# Altium schematic sheet Ethernet.SchDoc
size A3; DocumentNumber: 7; SheetNumber: 7; SheetTotal: 10; PageSetup: Record=PageOptions|CenterHorizontal=True|CenterVertical=True|PrintScale=0.97|XCorrection=1.00|YCorrection=1.00|PrintKind=1|BorderSize=5000000|LeftOffset=0|BottomOffset=0|Orientation=2|PaperLength=2970|PaperWidth=2100|Scale=100|PaperSource=7|PrintQuality=600|MediaType=1|DitherType=10|PaperKind=A4|PrintScaleMode=1
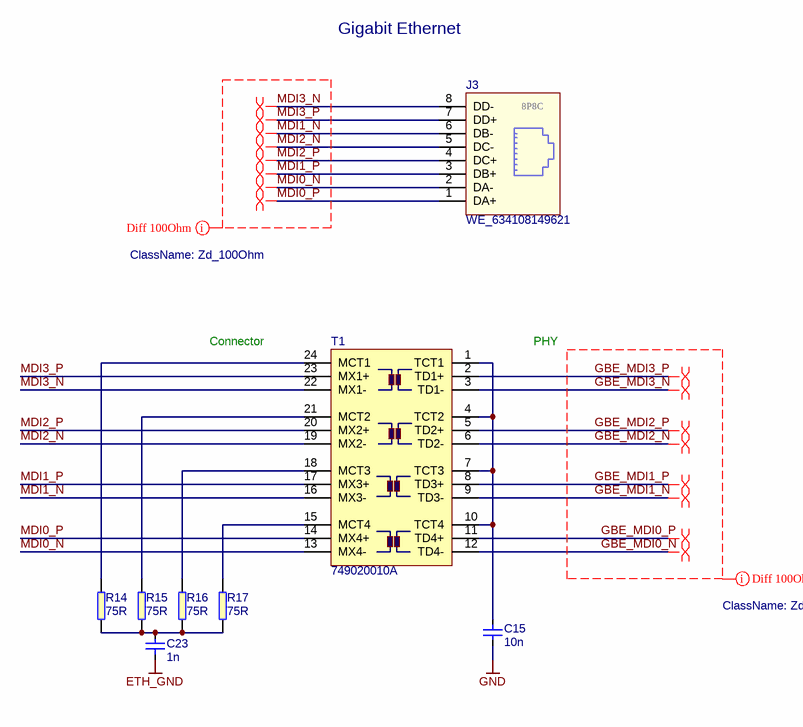
[diagram p0: Ethernet.SchDoc]

## Parts
C15  10n  [1206]
C23  1n  [1206]
J3  WE_634108149621  [WE_634108149621]
R14  75R  [0603]
R15  75R  [0603]
R16  75R  [0603]
R17  75R  [0603]
T1  749020010A  [Wurth-749020010A]

## Nets
ETH_GND: C23.1
GND: C15.2
GBE_MDI0_N: T1.12(TD4-)
GBE_MDI0_P: T1.11(TD4+)
GBE_MDI1_N: T1.9(TD3-)
GBE_MDI1_P: T1.8(TD3+)
GBE_MDI2_N: T1.6(TD2-)
GBE_MDI2_P: T1.5(TD2+)
GBE_MDI3_N: T1.3(TD1-)
GBE_MDI3_P: T1.2(TD1+)
MDI0_N: J3.2(DA-) T1.13(MX4-)
MDI0_P: J3.1(DA+) T1.14(MX4+)
MDI1_N: J3.6(DB-) T1.16(MX3-)
MDI1_P: J3.3(DB+) T1.17(MX3+)
MDI2_N: J3.5(DC-) T1.19(MX2-)
MDI2_P: J3.4(DC+) T1.20(MX2+)
MDI3_N: J3.8(DD-) T1.22(MX1-)
MDI3_P: J3.7(DD+) T1.23(MX1+)
NetC15_1: C15.1 T1.1(TCT1) T1.4(TCT2) T1.7(TCT3) T1.10(TCT4)
NetC23_2: C23.2 R14.1 R15.1 R16.1 R17.1
NetR14_2: R14.2 T1.24(MCT1)
NetR15_2: R15.2 T1.21(MCT2)
NetR16_2: R16.2 T1.18(MCT3)
NetR17_2: R17.2 T1.15(MCT4)

## Layout directives
differential pair: GBE_MDI0_N, GBE_MDI0_P, GBE_MDI1_N, GBE_MDI1_P, GBE_MDI2_N, GBE_MDI2_P, GBE_MDI3_N, GBE_MDI3_P, MDI0_N, MDI0_P, MDI1_N, MDI1_P, MDI2_N, MDI2_P, MDI3_N, MDI3_P
net class Zd_100Ohm: GBE_MDI0_N, GBE_MDI0_P, GBE_MDI1_N, GBE_MDI1_P, GBE_MDI2_N, GBE_MDI2_P, GBE_MDI3_N, GBE_MDI3_P, MDI0_N, MDI0_P, MDI1_N, MDI1_P, MDI2_N, MDI2_P, MDI3_N, MDI3_P

## Notes on the sheet
- Gigabit Ethernet
- Connector
- PHY
- Title:
- Size:
- Date:
- A3
- Revision:
- Page:
- of
- Antmicro Ltd.
- File:
- www.antmicro.com
- (in symbol WE_634108149621) 8P8C

## Library data of the parts
C15 = C_10n_1206: MLCC SMT Capacitor 10nF 1206; Manufacturer: MULTICOMP; Part Symbol: MC1206B103K631CT; Value: 10n; Part Number: C_10n_1206
C23 = C_1n_1206: MLCC SMT Capacitor 1nF 1206; Manufacturer: AVX; Part Symbol: 12061A102JAT2A; Value: 1n; Part Number: C_1n_1206
J3 = WE_634108149621: Modular Connectors / Ethernet Connectors WR-MJ Mod Jk 8P8C Solder Tab w/Mylar; Manufacturer: WURTH ELEKTRONIK; Part Number: WE_634108149621; Value: WE_634108149621; Part Symbol: 634108149621
R14-R17 = R_75R_0603: SMT Resistor 75R 0603; Manufacturer: MULTICOMP; Part Symbol: MCWR06X75R0FTL; Value: 75R; Part Number: R_75R_0603
T1 = Wurth-749020010A: LAN TRANSFORMER, 10/100/1000 BASE-T; Manufacturer: WURTH ELEKTRONIK; Part Number: Wurth-749020010A; Value: 749020010A; Part Symbol: 749020010A